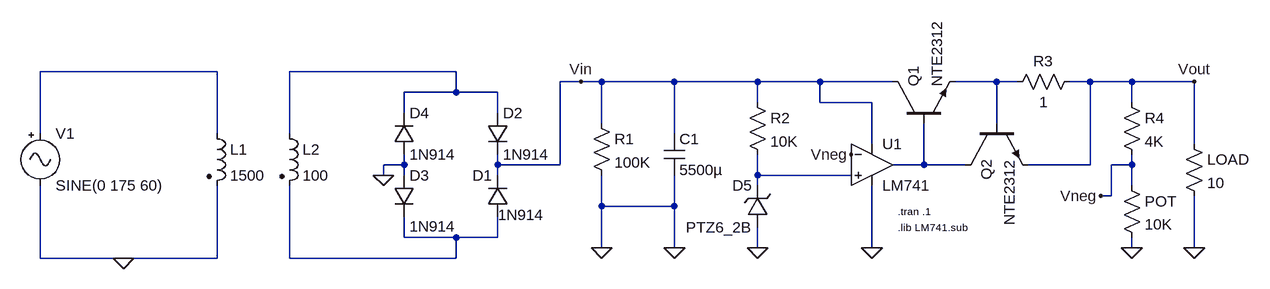
[diagram p0: schematic Final_Power_Supply.asc]
Final_Power_Supply.asc, the LTspice schematic file:
Version 4
SHEET 1 1784 680
WIRE 144 64 -128 64
WIRE 512 64 256 64
WIRE 704 80 672 80
WIRE 736 80 704 80
WIRE 848 80 736 80
WIRE 976 80 848 80
WIRE 1072 80 976 80
WIRE 1184 80 1072 80
WIRE 1344 80 1280 80
WIRE 1376 80 1344 80
WIRE 1488 80 1456 80
WIRE 1552 80 1488 80
WIRE 1648 80 1552 80
WIRE 512 96 512 64
WIRE 512 96 432 96
WIRE 576 96 512 96
WIRE 976 112 976 80
WIRE 1072 112 1072 80
WIRE 1152 112 1072 112
WIRE 1552 112 1552 80
WIRE 432 128 432 96
WIRE 576 128 576 96
WIRE 736 144 736 80
WIRE 1344 144 1344 80
WIRE -128 160 -128 64
WIRE 144 160 144 64
WIRE 256 160 256 64
WIRE 848 160 848 80
WIRE 1152 176 1152 112
WIRE 1648 176 1648 80
WIRE 432 208 432 192
WIRE 432 208 400 208
WIRE 576 208 576 192
WIRE 672 208 672 80
WIRE 672 208 576 208
WIRE 1232 208 1232 144
WIRE 1232 208 1184 208
WIRE 1296 208 1232 208
WIRE 1488 208 1488 80
WIRE 1488 208 1392 208
WIRE 1552 208 1552 192
WIRE 1552 208 1520 208
WIRE 400 224 400 208
WIRE 432 224 432 208
WIRE 576 224 576 208
WIRE 976 224 976 192
WIRE 1120 224 976 224
WIRE 976 240 976 224
WIRE 1552 240 1552 208
WIRE 1520 256 1520 208
WIRE 1520 256 1504 256
WIRE 736 272 736 224
WIRE 848 272 848 224
WIRE 848 272 736 272
WIRE 432 320 432 288
WIRE 512 320 432 320
WIRE 576 320 576 288
WIRE 576 320 512 320
WIRE 736 336 736 272
WIRE 848 336 848 272
WIRE 976 336 976 304
WIRE 1152 336 1152 240
WIRE 1552 336 1552 320
WIRE 1648 336 1648 256
WIRE -128 352 -128 240
WIRE 0 352 -128 352
WIRE 144 352 144 240
WIRE 144 352 0 352
WIRE 256 352 256 240
WIRE 512 352 512 320
WIRE 512 352 256 352
FLAG 1648 80 Vout
FLAG 1120 192 Vneg
FLAG 1504 256 Vneg
FLAG 704 80 Vin
FLAG 736 336 0
FLAG 848 336 0
FLAG 1648 336 0
FLAG 976 336 0
FLAG 1152 336 0
FLAG 1552 336 0
FLAG 400 224 0
FLAG 0 352 0
SYMBOL diode 560 128 R0
SYMATTR InstName D2
SYMATTR Value 1N914
SYMBOL diode 416 224 R0
WINDOW 3 24 79 Left 2
SYMATTR InstName D3
SYMATTR Value 1N914
SYMBOL diode 416 192 M180
WINDOW 0 24 64 Left 2
WINDOW 3 24 0 Left 2
SYMATTR InstName D4
SYMATTR Value 1N914
SYMBOL res 720 128 R0
SYMATTR InstName R1
SYMATTR Value 100K
SYMBOL cap 832 160 R0
SYMATTR InstName C1
SYMATTR Value 5500µ
SYMBOL res 960 96 R0
SYMATTR InstName R2
SYMATTR Value 10K
SYMBOL zener 992 304 R180
WINDOW 0 24 64 Left 2
WINDOW 3 24 0 Left 2
SYMATTR InstName D5
SYMATTR Value PTZ6_2B
SYMATTR Description Diode
SYMATTR Type diode
SYMBOL npn 1184 144 R270
SYMATTR InstName Q1
SYMATTR Value NTE2312
SYMBOL npn 1296 144 M90
SYMATTR InstName Q2
SYMATTR Value NTE2312
SYMBOL res 1472 64 R90
WINDOW 0 0 56 VBottom 2
WINDOW 3 32 56 VTop 2
SYMATTR InstName R3
SYMATTR Value 1
SYMBOL res 1536 96 R0
SYMATTR InstName R4
SYMATTR Value 4K
SYMBOL res 1536 224 R0
SYMATTR InstName POT
SYMATTR Value 10K
SYMBOL res 1632 160 R0
SYMATTR InstName LOAD
SYMATTR Value 10
SYMBOL diode 592 288 R180
WINDOW 0 24 64 Left 2
WINDOW 3 -56 3 Left 2
SYMATTR InstName D1
SYMATTR Value 1N914
SYMBOL Opamps\\opamp2 1152 144 R0
SYMATTR InstName U1
SYMATTR Value LM741
SYMBOL ind2 128 144 R0
SYMATTR InstName L1
SYMATTR Value 1500
SYMBOL ind2 240 144 R0
SYMATTR InstName L2
SYMATTR Value 100
SYMBOL Misc\\signal -128 144 R0
WINDOW 123 0 0 Left 0
WINDOW 39 0 0 Left 0
SYMATTR InstName V1
SYMATTR Value SINE(0 175 60)
TEXT 1192 280 Left 1 !.tran .1
TEXT 1192 304 Left 1 !.lib LM741.sub

The netlist it stands for:
* Final_Power_Supply.asc
D2 N002 Vin 1N914
D3 0 N006 1N914
D4 0 N002 1N914
R1 Vin 0 100K
C1 Vin 0 5500µ
R2 Vin N005 10K
D5 0 N005 PTZ6_2B
Q1 Vin N004 N003 0 NTE2312
Q2 N004 N003 Vout 0 NTE2312
R3 Vout N003 1
R4 Vout Vneg 4K
R§POT Vneg 0 10K
R§LOAD Vout 0 10
D1 N006 Vin 1N914
XU1 N005 Vneg Vin 0 N004 LM741  ; pins In+ In- V+ V- OUT
L1 N001 0 1500
L2 N002 N006 100
V1 N001 0 SINE(0 175 60)
.model D D
.lib standard.dio
.model NPN NPN
.model PNP PNP
.lib standard.bjt
.tran .1
.lib LM741.sub
.backanno
.end